# Altium project NCKH.PrjPcb
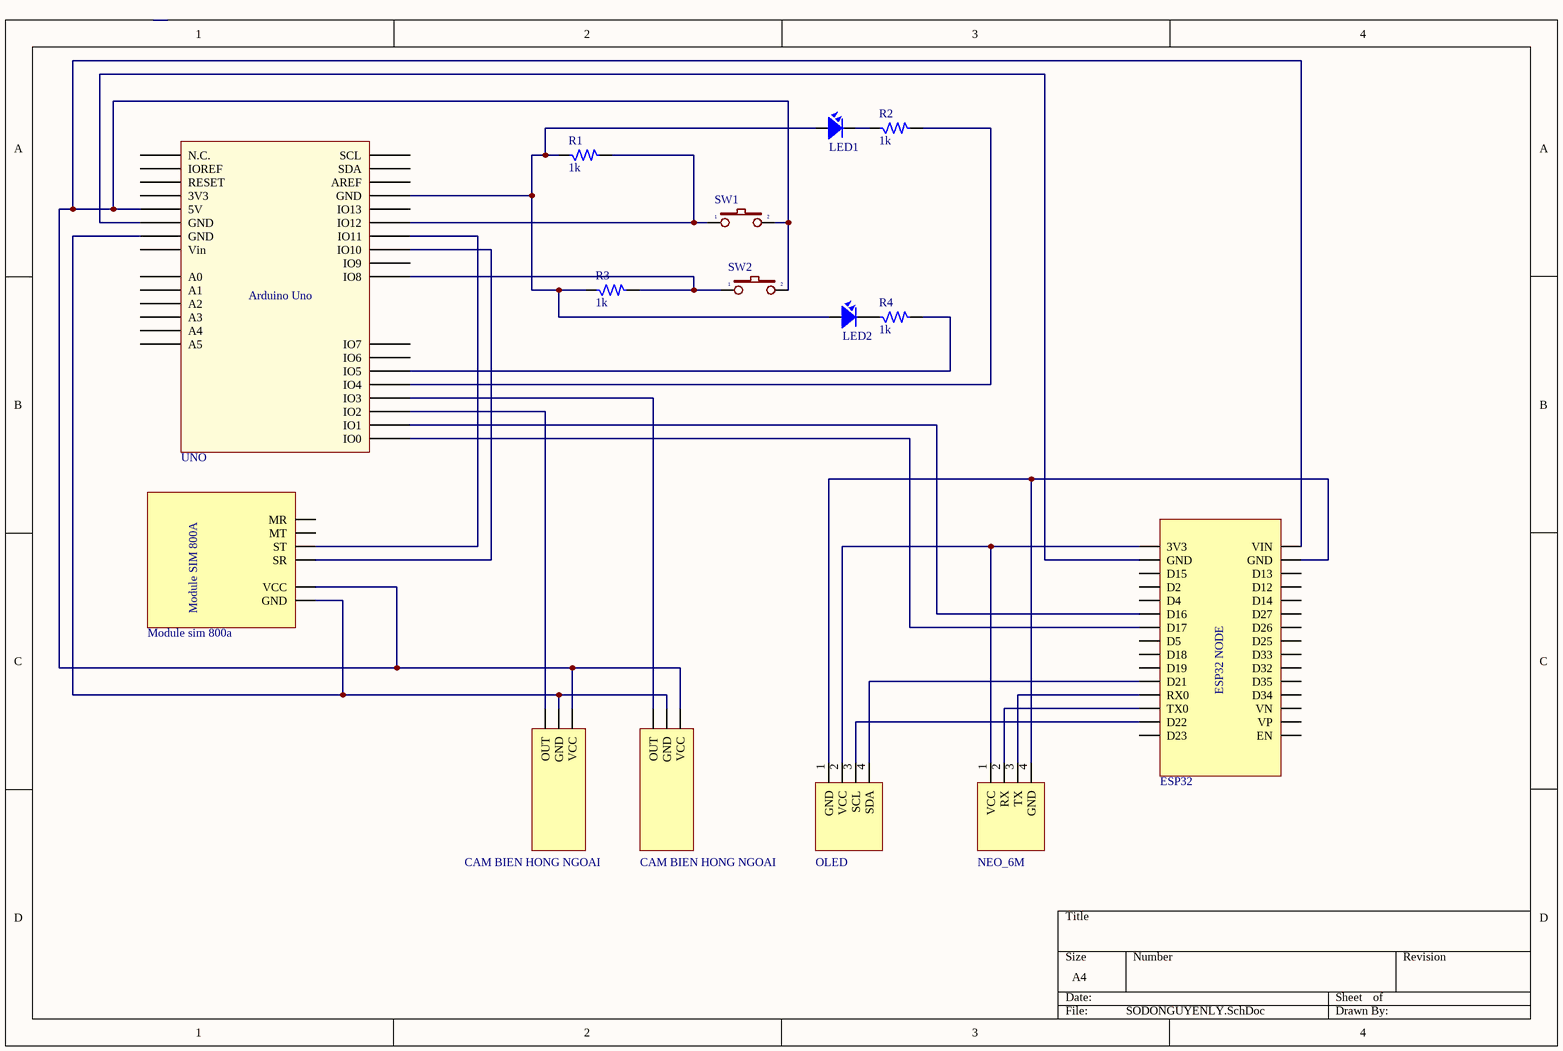
[diagram p0: SODONGUYENLY.SchDoc]
1 sheet, 15 parts. Net scope: global (net labels, ports and power ports of the same name join across sheets).

## Sheet SODONGUYENLY.SchDoc
size A4

### Parts
(Parts that share a designator on the sheet are numbered #1, #2 ... from top to bottom, then left to right.)
*IC?  Module sim 800a
*U?#1  OLED
*U?#2  NEO_6M
*U?#3  CAM BIEN HONG NGOAI
*U?#4  CAM BIEN HONG NGOAI
IC1  UNO
IC2  ESP32
LED1  LED  [LED-3]  (value not drawn)
LED2  LED  [LED-3]  (value not drawn)
R1  1k  [SM-RES-1206]
R2  1k  [SM-RES-1206]
R3  1k  [SM-RES-1206]
R4  1k  [SM-RES-1206]
SW1  SW  [SW2]  (value not drawn)
SW2  SW  [SW2]  (value not drawn)

### Nets
Net*IC?_3: *IC?.3(SR) IC1.10(IO10)
Net*IC?_3: *IC?.3(ST) IC1.11(IO11)  [a separate net that carries the same name]
Net*IC?_5: *IC?.5(VCC) *U?#3.1(VCC) *U?#4.1(VCC) IC1.5V IC2.30(VIN) SW1.2 SW2.2
Net*IC?_6: *IC?.6(GND) *U?#3.2(GND) *U?#4.2(GND) IC1.GND2(GND)
Net*U?#1_1: *U?#1.1(GND) *U?#2.4(GND) IC2.29(GND)
Net*U?#1_2: *U?#1.2(VCC) *U?#2.1(VCC) IC2.1(3V3)
Net*U?#1_3: *U?#1.3(SCL) IC2.14(D22)
Net*U?#1_4: *U?#1.4(SDA) IC2.11(D21)
Net*U?#2_2: *U?#2.2(RX) IC2.13(TX0)
Net*U?#2_3: *U?#2.3(TX) IC2.12(RX0)
Net*U?#3_3: *U?#3.3(OUT) IC1.2(IO2)
Net*U?#4_3: *U?#4.3(OUT) IC1.3(IO3)
NetIC1_0: IC1.0(IO0) IC2.7(D17)
NetIC1_1: IC1.1(IO1) IC2.6(D16)
NetIC1_4: IC1.4(IO4) R2.2
NetIC1_5: IC1.5(IO5) R4.2
NetIC1_8: IC1.8(IO8) R3.2 SW2.1
NetIC1_12: IC1.12(IO12) R1.2 SW1.1
NetIC1_GND1: IC1.GND1(GND) IC2.2(GND)
NetIC1_GND3: IC1.GND3(GND) LED1.1 LED2.1 R1.1 R3.1
NetLED1_2: LED1.2 R2.1
NetLED2_2: LED2.2 R4.1

Not connected (* = marked no-connect by the designer): *IC? 1(MR) 2(MT); IC1 3V3 6(IO6) 7(IO7) 9(IO9) 13(IO13) A0 A1 A2 A3 A4 A5 AREF IOREF NC(N.C.) RESET SCL SDA Vin; IC2 3(D15) 4(D2) 5(D4) 8(D5) 9(D18) 10(D19) 15(D23) 16(EN) 17(VP) 18(VN) 19(D34) 20(D35) 21(D32) 22(D33) 23(D25) 24(D26) 25(D27) 26(D14) 27(D12) 28(D13)

### Notes on the sheet
- (in symbol ESP32_LIB) ESP32 NODE
- (in symbol Module sim 800a) Module SIM 800A
- (in symbol UNO) Arduino Uno

### Library data of the parts
*U?#2 = GPS
*U?#3 *U?#4 = CLS2404A
IC2 = ESP32_LIB
LED1 LED2 = LED: LED Single colour Green and Red; Value: LED 3 ly Single Colour
R1-R4 = R: Resistor 1/4W; Value: R1/4W - 1K
SW1 SW2 = SW2: Switch button 2 pin; Value: SW chip 2 pin